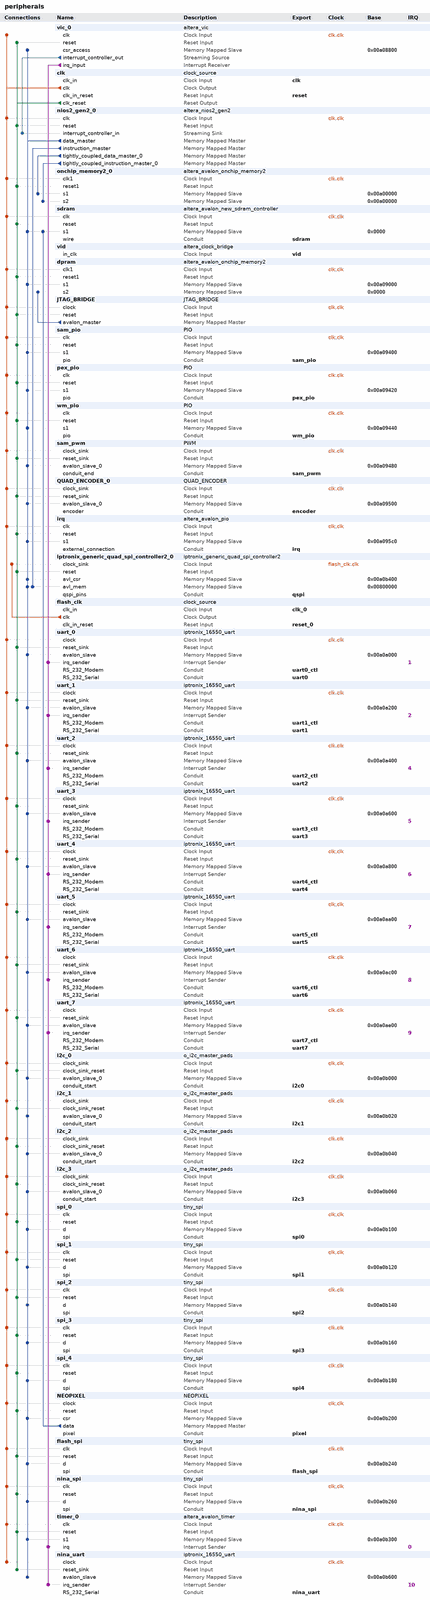
[diagram p0: system contents, whole]
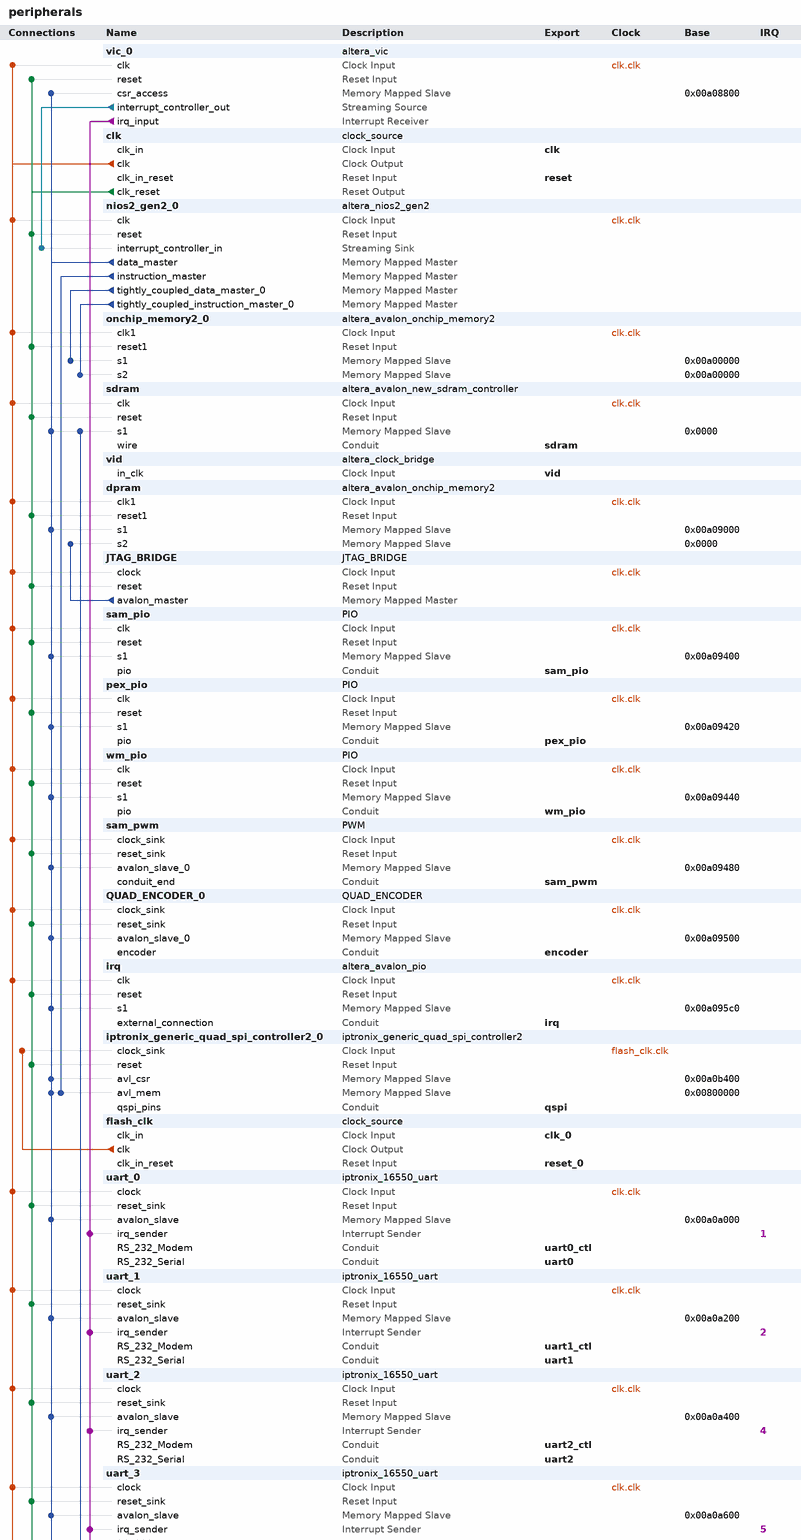
[diagram p1: system contents, upper part]
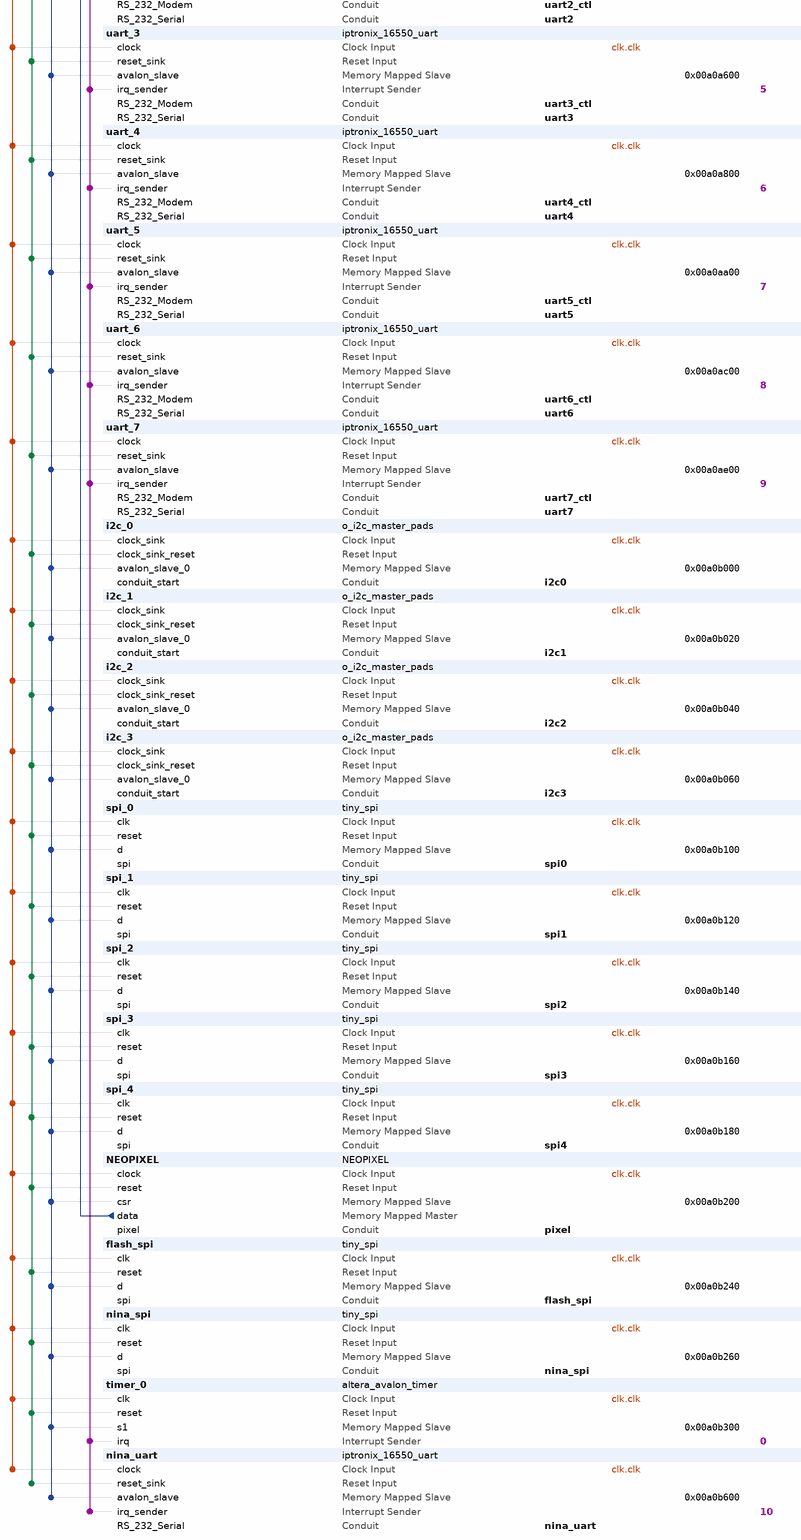
[diagram p2: system contents, lower part]
# Platform Designer (Qsys) system peripherals, Cyclone 10 LP 10CL016YU256C8G
# Parameters at their usual value, and those the tool derives, are not listed.
package require -exact qsys 18.0
create_system peripherals
set_project_property DEVICE_FAMILY {Cyclone 10 LP}
set_project_property DEVICE 10CL016YU256C8G

add_instance vic_0 altera_vic 18.0
set_instance_parameter_value vic_0 DAISY_CHAIN_ENABLE 0
set_instance_parameter_value vic_0 INTERRUPT_LATENCY_CYCLES 2
set_instance_parameter_value vic_0 NUMBER_OF_INT_PORTS 16
set_instance_parameter_value vic_0 OVERRIDE_INTERRUPT_LATENCY false
set_instance_parameter_value vic_0 RIL_WIDTH 4

add_instance clk clock_source 18.0
set_instance_parameter_value clk clockFrequency 100000000

add_instance nios2_gen2_0 altera_nios2_gen2 18.0
set_instance_parameter_value nios2_gen2_0 dcache_numTCDM 1
set_instance_parameter_value nios2_gen2_0 dcache_size 0
set_instance_parameter_value nios2_gen2_0 debug_enabled false
set_instance_parameter_value nios2_gen2_0 debug_hwbreakpoint 4
set_instance_parameter_value nios2_gen2_0 exceptionSlave onchip_memory2_0.s2
set_instance_parameter_value nios2_gen2_0 icache_numTCIM 1
set_instance_parameter_value nios2_gen2_0 icache_size 0
set_instance_parameter_value nios2_gen2_0 impl Fast
set_instance_parameter_value nios2_gen2_0 resetSlave onchip_memory2_0.s2
set_instance_parameter_value nios2_gen2_0 setting_interruptControllerType External
set_instance_parameter_value nios2_gen2_0 setting_shadowRegisterSets 1

add_instance onchip_memory2_0 altera_avalon_onchip_memory2 18.0
set_instance_parameter_value onchip_memory2_0 dataWidth 32
set_instance_parameter_value onchip_memory2_0 dualPort true
set_instance_parameter_value onchip_memory2_0 initMemContent true
set_instance_parameter_value onchip_memory2_0 initializationFileName onchip_mem.hex
set_instance_parameter_value onchip_memory2_0 memorySize 32768
set_instance_parameter_value onchip_memory2_0 singleClockOperation true

add_instance sdram altera_avalon_new_sdram_controller 18.0
set_instance_parameter_value sdram TAC 5.4
set_instance_parameter_value sdram TRCD 20.0
set_instance_parameter_value sdram TRP 20.0
set_instance_parameter_value sdram casLatency 2
set_instance_parameter_value sdram columnWidth 8
set_instance_parameter_value sdram dataWidth 16
set_instance_parameter_value sdram generateSimulationModel false
set_instance_parameter_value sdram model single_Micron_MT48LC4M32B2_7_chip
set_instance_parameter_value sdram numberOfBanks 4
set_instance_parameter_value sdram numberOfChipSelects 1
set_instance_parameter_value sdram powerUpDelay 200.0
set_instance_parameter_value sdram refreshPeriod 31.25
set_instance_parameter_value sdram rowWidth 12

add_instance vid altera_clock_bridge 18.0
set_instance_parameter_value vid DERIVED_CLOCK_RATE 0
set_instance_parameter_value vid EXPLICIT_CLOCK_RATE 0

add_instance dpram altera_avalon_onchip_memory2 18.0
set_instance_parameter_value dpram dataWidth 32
set_instance_parameter_value dpram dualPort true
set_instance_parameter_value dpram initMemContent true
set_instance_parameter_value dpram initializationFileName onchip_mem.hex
set_instance_parameter_value dpram memorySize 1024
set_instance_parameter_value dpram singleClockOperation true

add_instance JTAG_BRIDGE JTAG_BRIDGE 1.0

add_instance sam_pio PIO 1.0

add_instance pex_pio PIO 1.0

add_instance wm_pio PIO 1.0

add_instance sam_pwm PWM 1.0
set_instance_parameter_value sam_pwm pCHANNELS 23
set_instance_parameter_value sam_pwm pMATCH_BITS 16
set_instance_parameter_value sam_pwm pPRESCALER_BITS 32

add_instance QUAD_ENCODER_0 QUAD_ENCODER 1.0
set_instance_parameter_value QUAD_ENCODER_0 pENCODERS 11
set_instance_parameter_value QUAD_ENCODER_0 pENCODER_PRECISION 16

add_instance irq altera_avalon_pio 18.0
set_instance_parameter_value irq captureEdge true
set_instance_parameter_value irq direction InOut
set_instance_parameter_value irq generateIRQ true
set_instance_parameter_value irq irqType EDGE
set_instance_parameter_value irq width 2

add_instance iptronix_generic_quad_spi_controller2_0 iptronix_generic_quad_spi_controller2 18.0
set_instance_parameter_value iptronix_generic_quad_spi_controller2_0 ATOM UNIDIRECTIONAL
set_instance_parameter_value iptronix_generic_quad_spi_controller2_0 CHIP_SELS 1
set_instance_parameter_value iptronix_generic_quad_spi_controller2_0 FLASH_TYPE N25Q16
set_instance_parameter_value iptronix_generic_quad_spi_controller2_0 IO_MODE QUAD
set_instance_parameter_value iptronix_generic_quad_spi_controller2_0 clkFreq 40000000

add_instance flash_clk clock_source 18.0
set_instance_parameter_value flash_clk clockFrequency 40000000

add_instance uart_0 iptronix_16550_uart 18.0
set_instance_parameter_value uart_0 DMA_EXTRA 0
set_instance_parameter_value uart_0 FAMILY {Cyclone 10 LP}
set_instance_parameter_value uart_0 FIFO_DEPTH 128
set_instance_parameter_value uart_0 FIFO_HWFC 0
set_instance_parameter_value uart_0 FIFO_MODE 0
set_instance_parameter_value uart_0 FIFO_SWFC 0
set_instance_parameter_value uart_0 FIFO_WATERMARK 0
set_instance_parameter_value uart_0 MEM_BLOCK_TYPE AUTO

add_instance uart_1 iptronix_16550_uart 18.0
set_instance_parameter_value uart_1 DMA_EXTRA 0
set_instance_parameter_value uart_1 FAMILY {Cyclone 10 LP}
set_instance_parameter_value uart_1 FIFO_DEPTH 128
set_instance_parameter_value uart_1 FIFO_HWFC 0
set_instance_parameter_value uart_1 FIFO_MODE 0
set_instance_parameter_value uart_1 FIFO_SWFC 0
set_instance_parameter_value uart_1 FIFO_WATERMARK 0
set_instance_parameter_value uart_1 MEM_BLOCK_TYPE AUTO

add_instance uart_2 iptronix_16550_uart 18.0
set_instance_parameter_value uart_2 DMA_EXTRA 0
set_instance_parameter_value uart_2 FAMILY {Cyclone 10 LP}
set_instance_parameter_value uart_2 FIFO_DEPTH 128
set_instance_parameter_value uart_2 FIFO_HWFC 0
set_instance_parameter_value uart_2 FIFO_MODE 0
set_instance_parameter_value uart_2 FIFO_SWFC 0
set_instance_parameter_value uart_2 FIFO_WATERMARK 0
set_instance_parameter_value uart_2 MEM_BLOCK_TYPE AUTO

add_instance uart_3 iptronix_16550_uart 18.0
set_instance_parameter_value uart_3 DMA_EXTRA 0
set_instance_parameter_value uart_3 FAMILY {Cyclone 10 LP}
set_instance_parameter_value uart_3 FIFO_DEPTH 128
set_instance_parameter_value uart_3 FIFO_HWFC 0
set_instance_parameter_value uart_3 FIFO_MODE 0
set_instance_parameter_value uart_3 FIFO_SWFC 0
set_instance_parameter_value uart_3 FIFO_WATERMARK 0
set_instance_parameter_value uart_3 MEM_BLOCK_TYPE AUTO

add_instance uart_4 iptronix_16550_uart 18.0
set_instance_parameter_value uart_4 DMA_EXTRA 0
set_instance_parameter_value uart_4 FAMILY {Cyclone 10 LP}
set_instance_parameter_value uart_4 FIFO_DEPTH 128
set_instance_parameter_value uart_4 FIFO_HWFC 0
set_instance_parameter_value uart_4 FIFO_MODE 0
set_instance_parameter_value uart_4 FIFO_SWFC 0
set_instance_parameter_value uart_4 FIFO_WATERMARK 0
set_instance_parameter_value uart_4 MEM_BLOCK_TYPE AUTO

add_instance uart_5 iptronix_16550_uart 18.0
set_instance_parameter_value uart_5 DMA_EXTRA 0
set_instance_parameter_value uart_5 FAMILY {Cyclone 10 LP}
set_instance_parameter_value uart_5 FIFO_DEPTH 128
set_instance_parameter_value uart_5 FIFO_HWFC 0
set_instance_parameter_value uart_5 FIFO_MODE 0
set_instance_parameter_value uart_5 FIFO_SWFC 0
set_instance_parameter_value uart_5 FIFO_WATERMARK 0
set_instance_parameter_value uart_5 MEM_BLOCK_TYPE AUTO

add_instance uart_6 iptronix_16550_uart 18.0
set_instance_parameter_value uart_6 DMA_EXTRA 0
set_instance_parameter_value uart_6 FAMILY {Cyclone 10 LP}
set_instance_parameter_value uart_6 FIFO_DEPTH 128
set_instance_parameter_value uart_6 FIFO_HWFC 0
set_instance_parameter_value uart_6 FIFO_MODE 0
set_instance_parameter_value uart_6 FIFO_SWFC 0
set_instance_parameter_value uart_6 FIFO_WATERMARK 0
set_instance_parameter_value uart_6 MEM_BLOCK_TYPE AUTO

add_instance uart_7 iptronix_16550_uart 18.0
set_instance_parameter_value uart_7 DMA_EXTRA 0
set_instance_parameter_value uart_7 FAMILY {Cyclone 10 LP}
set_instance_parameter_value uart_7 FIFO_DEPTH 256
set_instance_parameter_value uart_7 FIFO_HWFC 0
set_instance_parameter_value uart_7 FIFO_MODE 0
set_instance_parameter_value uart_7 FIFO_SWFC 0
set_instance_parameter_value uart_7 FIFO_WATERMARK 0
set_instance_parameter_value uart_7 MEM_BLOCK_TYPE AUTO

add_instance i2c_0 o_i2c_master_pads 1.0

add_instance i2c_1 o_i2c_master_pads 1.0

add_instance i2c_2 o_i2c_master_pads 1.0

add_instance i2c_3 o_i2c_master_pads 1.0

add_instance spi_0 tiny_spi 1.0
set_instance_parameter_value spi_0 BAUD_DIV 0
set_instance_parameter_value spi_0 BAUD_WIDTH 8
set_instance_parameter_value spi_0 SPI_MODE 0

add_instance spi_1 tiny_spi 1.0
set_instance_parameter_value spi_1 BAUD_DIV 0
set_instance_parameter_value spi_1 BAUD_WIDTH 8
set_instance_parameter_value spi_1 SPI_MODE 0

add_instance spi_2 tiny_spi 1.0
set_instance_parameter_value spi_2 BAUD_DIV 0
set_instance_parameter_value spi_2 BAUD_WIDTH 8
set_instance_parameter_value spi_2 SPI_MODE 0

add_instance spi_3 tiny_spi 1.0
set_instance_parameter_value spi_3 BAUD_DIV 0
set_instance_parameter_value spi_3 BAUD_WIDTH 8
set_instance_parameter_value spi_3 SPI_MODE 0

add_instance spi_4 tiny_spi 1.0
set_instance_parameter_value spi_4 BAUD_DIV 0
set_instance_parameter_value spi_4 BAUD_WIDTH 8
set_instance_parameter_value spi_4 SPI_MODE 0

add_instance NEOPIXEL NEOPIXEL 1.0
set_instance_parameter_value NEOPIXEL pCHANNELS 4
set_instance_parameter_value NEOPIXEL pSTART_ADDRESS 0

add_instance flash_spi tiny_spi 1.0
set_instance_parameter_value flash_spi BAUD_DIV 0
set_instance_parameter_value flash_spi BAUD_WIDTH 8
set_instance_parameter_value flash_spi SPI_MODE 0

add_instance nina_spi tiny_spi 1.0
set_instance_parameter_value nina_spi BAUD_DIV 0
set_instance_parameter_value nina_spi BAUD_WIDTH 8
set_instance_parameter_value nina_spi SPI_MODE 0

add_instance timer_0 altera_avalon_timer 18.0
set_instance_parameter_value timer_0 period 1
set_instance_parameter_value timer_0 periodUnits MSEC

add_instance nina_uart iptronix_16550_uart 18.0
set_instance_parameter_value nina_uart DMA_EXTRA 0
set_instance_parameter_value nina_uart FAMILY {Cyclone 10 LP}
set_instance_parameter_value nina_uart FIFO_DEPTH 128
set_instance_parameter_value nina_uart FIFO_HWFC 0
set_instance_parameter_value nina_uart FIFO_MODE 0
set_instance_parameter_value nina_uart FIFO_SWFC 0
set_instance_parameter_value nina_uart FIFO_WATERMARK 0
set_instance_parameter_value nina_uart MEM_BLOCK_TYPE AUTO

# connections
add_connection clk.clk dpram.clk1 clock
add_connection clk.clk flash_spi.clk clock
add_connection clk.clk i2c_0.clock_sink clock
add_connection clk.clk i2c_1.clock_sink clock
add_connection clk.clk i2c_2.clock_sink clock
add_connection clk.clk i2c_3.clock_sink clock
add_connection clk.clk irq.clk clock
add_connection clk.clk JTAG_BRIDGE.clock clock
add_connection clk.clk NEOPIXEL.clock clock
add_connection clk.clk nina_spi.clk clock
add_connection clk.clk nina_uart.clock clock
add_connection clk.clk nios2_gen2_0.clk clock
add_connection clk.clk onchip_memory2_0.clk1 clock
add_connection clk.clk pex_pio.clk clock
add_connection clk.clk QUAD_ENCODER_0.clock_sink clock
add_connection clk.clk sam_pio.clk clock
add_connection clk.clk sam_pwm.clock_sink clock
add_connection clk.clk sdram.clk clock
add_connection clk.clk spi_0.clk clock
add_connection clk.clk spi_1.clk clock
add_connection clk.clk spi_2.clk clock
add_connection clk.clk spi_3.clk clock
add_connection clk.clk spi_4.clk clock
add_connection clk.clk timer_0.clk clock
add_connection clk.clk uart_0.clock clock
add_connection clk.clk uart_1.clock clock
add_connection clk.clk uart_2.clock clock
add_connection clk.clk uart_3.clock clock
add_connection clk.clk uart_4.clock clock
add_connection clk.clk uart_5.clock clock
add_connection clk.clk uart_6.clock clock
add_connection clk.clk uart_7.clock clock
add_connection clk.clk vic_0.clk clock
add_connection clk.clk wm_pio.clk clock
add_connection flash_clk.clk iptronix_generic_quad_spi_controller2_0.clock_sink clock
add_connection clk.clk_reset dpram.reset1 reset
add_connection clk.clk_reset flash_spi.reset reset
add_connection clk.clk_reset i2c_0.clock_sink_reset reset
add_connection clk.clk_reset i2c_1.clock_sink_reset reset
add_connection clk.clk_reset i2c_2.clock_sink_reset reset
add_connection clk.clk_reset i2c_3.clock_sink_reset reset
add_connection clk.clk_reset iptronix_generic_quad_spi_controller2_0.reset reset
add_connection clk.clk_reset irq.reset reset
add_connection clk.clk_reset JTAG_BRIDGE.reset reset
add_connection clk.clk_reset NEOPIXEL.reset reset
add_connection clk.clk_reset nina_spi.reset reset
add_connection clk.clk_reset nina_uart.reset_sink reset
add_connection clk.clk_reset nios2_gen2_0.reset reset
add_connection clk.clk_reset onchip_memory2_0.reset1 reset
add_connection clk.clk_reset pex_pio.reset reset
add_connection clk.clk_reset QUAD_ENCODER_0.reset_sink reset
add_connection clk.clk_reset sam_pio.reset reset
add_connection clk.clk_reset sam_pwm.reset_sink reset
add_connection clk.clk_reset sdram.reset reset
add_connection clk.clk_reset spi_0.reset reset
add_connection clk.clk_reset spi_1.reset reset
add_connection clk.clk_reset spi_2.reset reset
add_connection clk.clk_reset spi_3.reset reset
add_connection clk.clk_reset spi_4.reset reset
add_connection clk.clk_reset timer_0.reset reset
add_connection clk.clk_reset uart_0.reset_sink reset
add_connection clk.clk_reset uart_1.reset_sink reset
add_connection clk.clk_reset uart_2.reset_sink reset
add_connection clk.clk_reset uart_3.reset_sink reset
add_connection clk.clk_reset uart_4.reset_sink reset
add_connection clk.clk_reset uart_5.reset_sink reset
add_connection clk.clk_reset uart_6.reset_sink reset
add_connection clk.clk_reset uart_7.reset_sink reset
add_connection clk.clk_reset vic_0.reset reset
add_connection clk.clk_reset wm_pio.reset reset
add_connection JTAG_BRIDGE.avalon_master dpram.s2 avalon
set_connection_parameter_value JTAG_BRIDGE.avalon_master/dpram.s2 baseAddress 0x0000
add_connection NEOPIXEL.data sdram.s1 avalon
set_connection_parameter_value NEOPIXEL.data/sdram.s1 baseAddress 0x0000
add_connection nios2_gen2_0.data_master dpram.s1 avalon
set_connection_parameter_value nios2_gen2_0.data_master/dpram.s1 baseAddress 0x00a09000
add_connection nios2_gen2_0.data_master flash_spi.d avalon
set_connection_parameter_value nios2_gen2_0.data_master/flash_spi.d baseAddress 0x00a0b240
add_connection nios2_gen2_0.data_master i2c_0.avalon_slave_0 avalon
set_connection_parameter_value nios2_gen2_0.data_master/i2c_0.avalon_slave_0 baseAddress 0x00a0b000
add_connection nios2_gen2_0.data_master i2c_1.avalon_slave_0 avalon
set_connection_parameter_value nios2_gen2_0.data_master/i2c_1.avalon_slave_0 baseAddress 0x00a0b020
add_connection nios2_gen2_0.data_master i2c_2.avalon_slave_0 avalon
set_connection_parameter_value nios2_gen2_0.data_master/i2c_2.avalon_slave_0 baseAddress 0x00a0b040
add_connection nios2_gen2_0.data_master i2c_3.avalon_slave_0 avalon
set_connection_parameter_value nios2_gen2_0.data_master/i2c_3.avalon_slave_0 baseAddress 0x00a0b060
add_connection nios2_gen2_0.data_master iptronix_generic_quad_spi_controller2_0.avl_csr avalon
set_connection_parameter_value nios2_gen2_0.data_master/iptronix_generic_quad_spi_controller2_0.avl_csr baseAddress 0x00a0b400
add_connection nios2_gen2_0.data_master iptronix_generic_quad_spi_controller2_0.avl_mem avalon
set_connection_parameter_value nios2_gen2_0.data_master/iptronix_generic_quad_spi_controller2_0.avl_mem baseAddress 0x00800000
add_connection nios2_gen2_0.data_master irq.s1 avalon
set_connection_parameter_value nios2_gen2_0.data_master/irq.s1 baseAddress 0x00a095c0
add_connection nios2_gen2_0.data_master NEOPIXEL.csr avalon
set_connection_parameter_value nios2_gen2_0.data_master/NEOPIXEL.csr baseAddress 0x00a0b200
add_connection nios2_gen2_0.data_master nina_spi.d avalon
set_connection_parameter_value nios2_gen2_0.data_master/nina_spi.d baseAddress 0x00a0b260
add_connection nios2_gen2_0.data_master nina_uart.avalon_slave avalon
set_connection_parameter_value nios2_gen2_0.data_master/nina_uart.avalon_slave baseAddress 0x00a0b600
add_connection nios2_gen2_0.data_master pex_pio.s1 avalon
set_connection_parameter_value nios2_gen2_0.data_master/pex_pio.s1 baseAddress 0x00a09420
add_connection nios2_gen2_0.data_master QUAD_ENCODER_0.avalon_slave_0 avalon
set_connection_parameter_value nios2_gen2_0.data_master/QUAD_ENCODER_0.avalon_slave_0 baseAddress 0x00a09500
add_connection nios2_gen2_0.data_master sam_pio.s1 avalon
set_connection_parameter_value nios2_gen2_0.data_master/sam_pio.s1 baseAddress 0x00a09400
add_connection nios2_gen2_0.data_master sam_pwm.avalon_slave_0 avalon
set_connection_parameter_value nios2_gen2_0.data_master/sam_pwm.avalon_slave_0 baseAddress 0x00a09480
add_connection nios2_gen2_0.data_master sdram.s1 avalon
set_connection_parameter_value nios2_gen2_0.data_master/sdram.s1 baseAddress 0x0000
add_connection nios2_gen2_0.data_master spi_0.d avalon
set_connection_parameter_value nios2_gen2_0.data_master/spi_0.d baseAddress 0x00a0b100
add_connection nios2_gen2_0.data_master spi_1.d avalon
set_connection_parameter_value nios2_gen2_0.data_master/spi_1.d baseAddress 0x00a0b120
add_connection nios2_gen2_0.data_master spi_2.d avalon
set_connection_parameter_value nios2_gen2_0.data_master/spi_2.d baseAddress 0x00a0b140
add_connection nios2_gen2_0.data_master spi_3.d avalon
set_connection_parameter_value nios2_gen2_0.data_master/spi_3.d baseAddress 0x00a0b160
add_connection nios2_gen2_0.data_master spi_4.d avalon
set_connection_parameter_value nios2_gen2_0.data_master/spi_4.d baseAddress 0x00a0b180
add_connection nios2_gen2_0.data_master timer_0.s1 avalon
set_connection_parameter_value nios2_gen2_0.data_master/timer_0.s1 baseAddress 0x00a0b300
add_connection nios2_gen2_0.data_master uart_0.avalon_slave avalon
set_connection_parameter_value nios2_gen2_0.data_master/uart_0.avalon_slave baseAddress 0x00a0a000
add_connection nios2_gen2_0.data_master uart_1.avalon_slave avalon
set_connection_parameter_value nios2_gen2_0.data_master/uart_1.avalon_slave baseAddress 0x00a0a200
add_connection nios2_gen2_0.data_master uart_2.avalon_slave avalon
set_connection_parameter_value nios2_gen2_0.data_master/uart_2.avalon_slave baseAddress 0x00a0a400
add_connection nios2_gen2_0.data_master uart_3.avalon_slave avalon
set_connection_parameter_value nios2_gen2_0.data_master/uart_3.avalon_slave baseAddress 0x00a0a600
add_connection nios2_gen2_0.data_master uart_4.avalon_slave avalon
set_connection_parameter_value nios2_gen2_0.data_master/uart_4.avalon_slave baseAddress 0x00a0a800
add_connection nios2_gen2_0.data_master uart_5.avalon_slave avalon
set_connection_parameter_value nios2_gen2_0.data_master/uart_5.avalon_slave baseAddress 0x00a0aa00
add_connection nios2_gen2_0.data_master uart_6.avalon_slave avalon
set_connection_parameter_value nios2_gen2_0.data_master/uart_6.avalon_slave baseAddress 0x00a0ac00
add_connection nios2_gen2_0.data_master uart_7.avalon_slave avalon
set_connection_parameter_value nios2_gen2_0.data_master/uart_7.avalon_slave baseAddress 0x00a0ae00
add_connection nios2_gen2_0.data_master vic_0.csr_access avalon
set_connection_parameter_value nios2_gen2_0.data_master/vic_0.csr_access baseAddress 0x00a08800
add_connection nios2_gen2_0.data_master wm_pio.s1 avalon
set_connection_parameter_value nios2_gen2_0.data_master/wm_pio.s1 baseAddress 0x00a09440
add_connection nios2_gen2_0.instruction_master iptronix_generic_quad_spi_controller2_0.avl_mem avalon
set_connection_parameter_value nios2_gen2_0.instruction_master/iptronix_generic_quad_spi_controller2_0.avl_mem baseAddress 0x00800000
add_connection nios2_gen2_0.tightly_coupled_data_master_0 onchip_memory2_0.s1 avalon
set_connection_parameter_value nios2_gen2_0.tightly_coupled_data_master_0/onchip_memory2_0.s1 baseAddress 0x00a00000
add_connection nios2_gen2_0.tightly_coupled_instruction_master_0 onchip_memory2_0.s2 avalon
set_connection_parameter_value nios2_gen2_0.tightly_coupled_instruction_master_0/onchip_memory2_0.s2 baseAddress 0x00a00000
add_connection vic_0.interrupt_controller_out nios2_gen2_0.interrupt_controller_in avalon_streaming
add_connection vic_0.irq_input nina_uart.irq_sender interrupt
set_connection_parameter_value vic_0.irq_input/nina_uart.irq_sender irqNumber 10
add_connection vic_0.irq_input timer_0.irq interrupt
set_connection_parameter_value vic_0.irq_input/timer_0.irq irqNumber 0
add_connection vic_0.irq_input uart_0.irq_sender interrupt
set_connection_parameter_value vic_0.irq_input/uart_0.irq_sender irqNumber 1
add_connection vic_0.irq_input uart_1.irq_sender interrupt
set_connection_parameter_value vic_0.irq_input/uart_1.irq_sender irqNumber 2
add_connection vic_0.irq_input uart_2.irq_sender interrupt
set_connection_parameter_value vic_0.irq_input/uart_2.irq_sender irqNumber 4
add_connection vic_0.irq_input uart_3.irq_sender interrupt
set_connection_parameter_value vic_0.irq_input/uart_3.irq_sender irqNumber 5
add_connection vic_0.irq_input uart_4.irq_sender interrupt
set_connection_parameter_value vic_0.irq_input/uart_4.irq_sender irqNumber 6
add_connection vic_0.irq_input uart_5.irq_sender interrupt
set_connection_parameter_value vic_0.irq_input/uart_5.irq_sender irqNumber 7
add_connection vic_0.irq_input uart_6.irq_sender interrupt
set_connection_parameter_value vic_0.irq_input/uart_6.irq_sender irqNumber 8
add_connection vic_0.irq_input uart_7.irq_sender interrupt
set_connection_parameter_value vic_0.irq_input/uart_7.irq_sender irqNumber 9

# exported interfaces
add_interface clk clock sink
set_interface_property clk EXPORT_OF clk.clk_in
add_interface clk_0 clock sink
set_interface_property clk_0 EXPORT_OF flash_clk.clk_in
add_interface encoder conduit end
set_interface_property encoder EXPORT_OF QUAD_ENCODER_0.encoder
add_interface flash_spi conduit end
set_interface_property flash_spi EXPORT_OF flash_spi.spi
add_interface i2c0 conduit end
set_interface_property i2c0 EXPORT_OF i2c_0.conduit_start
add_interface i2c1 conduit end
set_interface_property i2c1 EXPORT_OF i2c_1.conduit_start
add_interface i2c2 conduit end
set_interface_property i2c2 EXPORT_OF i2c_2.conduit_start
add_interface i2c3 conduit end
set_interface_property i2c3 EXPORT_OF i2c_3.conduit_start
add_interface irq conduit end
set_interface_property irq EXPORT_OF irq.external_connection
add_interface nina_spi conduit end
set_interface_property nina_spi EXPORT_OF nina_spi.spi
add_interface nina_uart conduit end
set_interface_property nina_uart EXPORT_OF nina_uart.RS_232_Serial
add_interface pex_pio conduit end
set_interface_property pex_pio EXPORT_OF pex_pio.pio
add_interface pixel conduit end
set_interface_property pixel EXPORT_OF NEOPIXEL.pixel
add_interface qspi conduit end
set_interface_property qspi EXPORT_OF iptronix_generic_quad_spi_controller2_0.qspi_pins
add_interface reset reset sink
set_interface_property reset EXPORT_OF clk.clk_in_reset
add_interface reset_0 reset sink
set_interface_property reset_0 EXPORT_OF flash_clk.clk_in_reset
add_interface sam_pio conduit end
set_interface_property sam_pio EXPORT_OF sam_pio.pio
add_interface sam_pwm conduit end
set_interface_property sam_pwm EXPORT_OF sam_pwm.conduit_end
add_interface sdram conduit end
set_interface_property sdram EXPORT_OF sdram.wire
add_interface spi0 conduit end
set_interface_property spi0 EXPORT_OF spi_0.spi
add_interface spi1 conduit end
set_interface_property spi1 EXPORT_OF spi_1.spi
add_interface spi2 conduit end
set_interface_property spi2 EXPORT_OF spi_2.spi
add_interface spi3 conduit end
set_interface_property spi3 EXPORT_OF spi_3.spi
add_interface spi4 conduit end
set_interface_property spi4 EXPORT_OF spi_4.spi
add_interface uart0 conduit end
set_interface_property uart0 EXPORT_OF uart_0.RS_232_Serial
add_interface uart0_ctl conduit end
set_interface_property uart0_ctl EXPORT_OF uart_0.RS_232_Modem
add_interface uart1 conduit end
set_interface_property uart1 EXPORT_OF uart_1.RS_232_Serial
add_interface uart1_ctl conduit end
set_interface_property uart1_ctl EXPORT_OF uart_1.RS_232_Modem
add_interface uart2 conduit end
set_interface_property uart2 EXPORT_OF uart_2.RS_232_Serial
add_interface uart2_ctl conduit end
set_interface_property uart2_ctl EXPORT_OF uart_2.RS_232_Modem
add_interface uart3 conduit end
set_interface_property uart3 EXPORT_OF uart_3.RS_232_Serial
add_interface uart3_ctl conduit end
set_interface_property uart3_ctl EXPORT_OF uart_3.RS_232_Modem
add_interface uart4 conduit end
set_interface_property uart4 EXPORT_OF uart_4.RS_232_Serial
add_interface uart4_ctl conduit end
set_interface_property uart4_ctl EXPORT_OF uart_4.RS_232_Modem
add_interface uart5 conduit end
set_interface_property uart5 EXPORT_OF uart_5.RS_232_Serial
add_interface uart5_ctl conduit end
set_interface_property uart5_ctl EXPORT_OF uart_5.RS_232_Modem
add_interface uart6 conduit end
set_interface_property uart6 EXPORT_OF uart_6.RS_232_Serial
add_interface uart6_ctl conduit end
set_interface_property uart6_ctl EXPORT_OF uart_6.RS_232_Modem
add_interface uart7 conduit end
set_interface_property uart7 EXPORT_OF uart_7.RS_232_Serial
add_interface uart7_ctl conduit end
set_interface_property uart7_ctl EXPORT_OF uart_7.RS_232_Modem
add_interface vid clock sink
set_interface_property vid EXPORT_OF vid.in_clk
add_interface wm_pio conduit end
set_interface_property wm_pio EXPORT_OF wm_pio.pio

set_interconnect_requirement {$system} qsys_mm.clockCrossingAdapter HANDSHAKE
set_interconnect_requirement {$system} qsys_mm.enableEccProtection FALSE
set_interconnect_requirement {$system} qsys_mm.insertDefaultSlave FALSE
set_interconnect_requirement {$system} qsys_mm.maxAdditionalLatency 1

save_system peripherals.qsys
